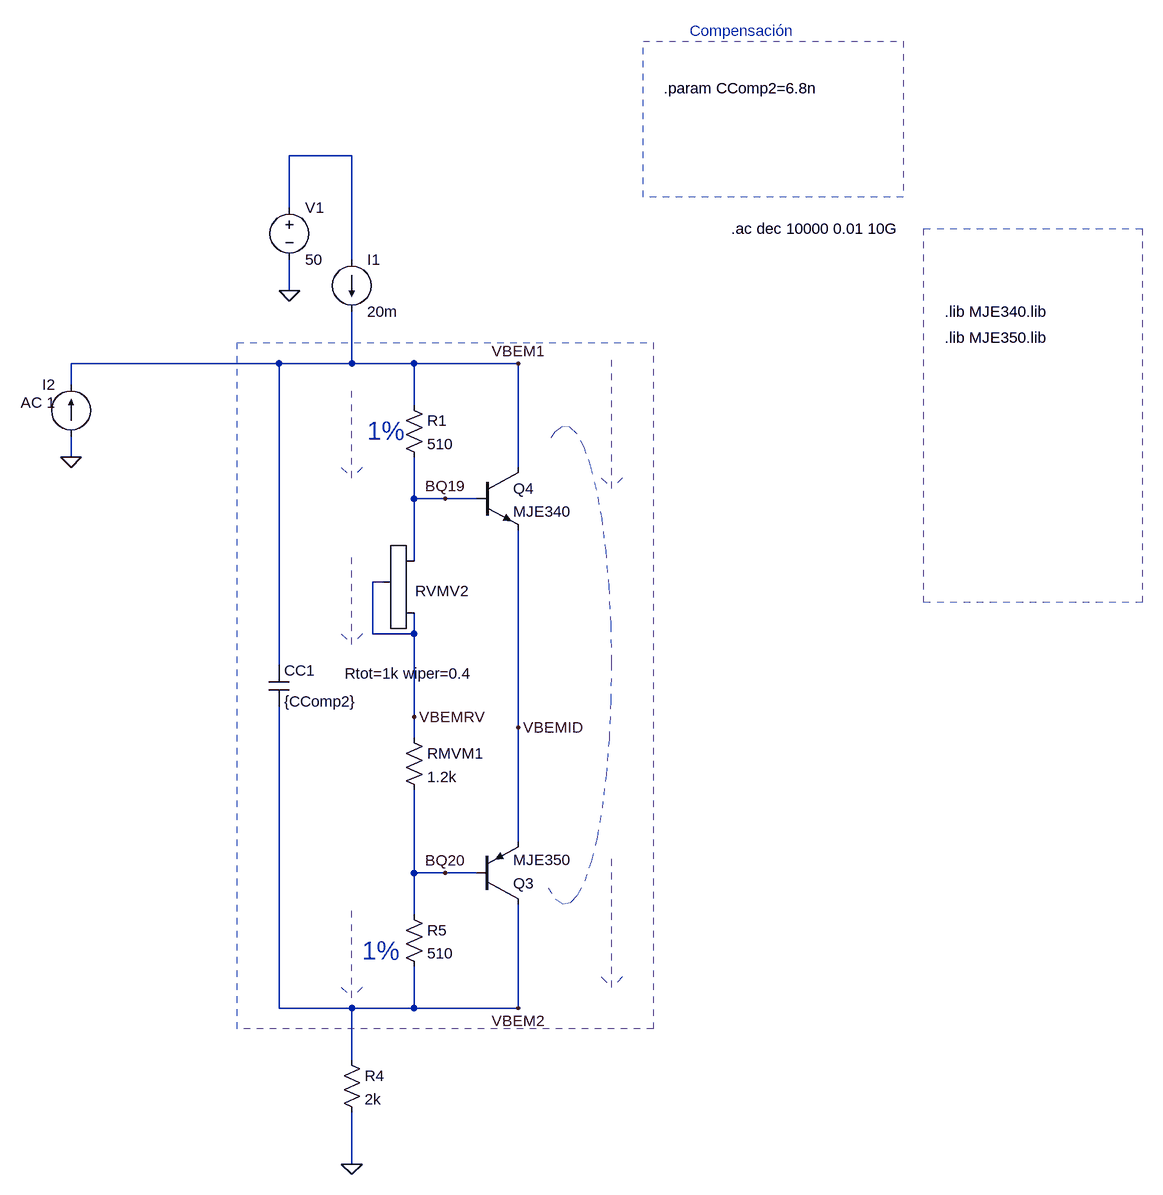
[diagram p0: schematic vbe_mult.asc]
vbe_mult.asc, the LTspice schematic file:
Version 4
SHEET 1 1316 964
WIRE 96 -608 0 -608
WIRE 0 -528 0 -608
WIRE 96 -448 96 -608
WIRE 0 -400 0 -448
WIRE -16 -288 -336 -288
WIRE 96 -288 96 -368
WIRE 96 -288 -16 -288
WIRE 192 -288 96 -288
WIRE 352 -288 192 -288
WIRE -336 -256 -336 -288
WIRE 192 -224 192 -288
WIRE -336 -144 -336 -176
WIRE 352 -128 352 -288
WIRE 192 -80 192 -144
WIRE 240 -80 192 -80
WIRE 288 -80 240 -80
WIRE 192 16 192 -80
WIRE 144 48 128 48
WIRE 128 128 128 48
WIRE 192 128 192 96
WIRE 192 128 128 128
WIRE -16 176 -16 -288
WIRE 192 256 192 128
WIRE 352 272 352 -32
WIRE 192 288 192 256
WIRE 352 448 352 272
WIRE 192 496 192 368
WIRE 240 496 192 496
WIRE 288 496 240 496
WIRE 192 560 192 496
WIRE -16 704 -16 240
WIRE 96 704 -16 704
WIRE 192 704 192 640
WIRE 192 704 96 704
WIRE 352 704 352 544
WIRE 352 704 192 704
WIRE 96 784 96 704
WIRE 96 944 96 864
FLAG 0 -400 0
FLAG 96 944 0
FLAG -336 -144 0
FLAG 352 -288 VBEM1
FLAG 352 704 VBEM2
FLAG 352 272 VBEMID
FLAG 240 -80 BQ19
FLAG 240 496 BQ20
FLAG 192 256 VBEMRV
DATAFLAG 496 208 "V(vbem1)-V(vbem2)"
DATAFLAG 496 704 ""
DATAFLAG 352 80 ""
DATAFLAG 496 -192 "Ic(Q19)"
DATAFLAG 496 576 "-Ic(Q20)"
DATAFLAG 192 -80 ""
DATAFLAG 192 496 ""
DATAFLAG 96 48 "I(RMVM)"
DATAFLAG 96 -208 "I(R21)"
DATAFLAG 96 592 "I(R22)"
SYMBOL current 96 -448 R0
SYMATTR InstName I1
SYMATTR Value 20m
SYMBOL voltage 0 -544 R0
SYMATTR InstName V1
SYMATTR Value 50
SYMBOL res 80 768 R0
SYMATTR InstName R4
SYMATTR Value 2k
SYMBOL current -336 -176 R180
WINDOW 0 24 80 Left 2
WINDOW 3 24 0 Left 2
WINDOW 123 24 52 Left 2
WINDOW 39 0 0 Left 0
SYMATTR InstName I2
SYMATTR Value ""
SYMATTR Value2 AC 1
SYMBOL pnp 288 544 M180
SYMATTR InstName Q3
SYMATTR Value MJE350
SYMBOL npn 288 -128 R0
SYMATTR InstName Q4
SYMATTR Value MJE340
SYMBOL res 176 -240 R0
SYMATTR InstName R1
SYMATTR Value 510
SYMBOL res 176 544 R0
SYMATTR InstName R5
SYMATTR Value 510
SYMBOL potentiometer_standard 208 112 R180
WINDOW 3 -74 -77 Left 2
WINDOW 0 -68 50 Left 2
WINDOW 38 50 -51 Left 2
SYMATTR Value Rtot=1k wiper=0.4
SYMATTR InstName RVMV2
SYMATTR SpiceLine ""
SYMBOL cap -32 176 R0
SYMATTR InstName CC1
SYMATTR Value {CComp2}
SYMBOL res 176 272 R0
SYMATTR InstName RMVM1
SYMATTR Value 1.2k
TEXT 680 -496 Left 2 !.ac dec 10000 0.01 10G
TEXT 1008 -368 Left 2 !.lib MJE340.lib
TEXT 1008 -328 Left 2 !.lib MJE350.lib
TEXT 120 -184 Left 4 ;1%
TEXT 112 616 Left 4 ;1%
TEXT 616 -800 Left 2 ;Compensación
TEXT 576 -712 Left 2 !.param CComp2=6.8n
LINE Normal 496 -96 496 -304 2
LINE Normal 496 -96 496 -96 2
LINE Normal 496 -96 496 -96 2
LINE Normal 480 -112 496 -96 2
LINE Normal 480 -112 480 -112 2
LINE Normal 512 -112 496 -96 2
LINE Normal 496 672 496 464 2
LINE Normal 496 672 496 672 2
LINE Normal 496 672 496 672 2
LINE Normal 480 656 496 672 2
LINE Normal 480 656 480 656 2
LINE Normal 512 656 496 672 2
LINE Normal 96 144 96 0 2
LINE Normal 96 144 96 144 2
LINE Normal 96 144 96 144 2
LINE Normal 80 128 96 144 2
LINE Normal 80 128 80 128 2
LINE Normal 112 128 96 144 2
LINE Normal 96 -112 96 -256 2
LINE Normal 96 -112 96 -112 2
LINE Normal 96 -112 96 -112 2
LINE Normal 80 -128 96 -112 2
LINE Normal 80 -128 80 -128 2
LINE Normal 112 -128 96 -112 2
LINE Normal 96 688 96 544 2
LINE Normal 96 688 96 688 2
LINE Normal 96 688 96 688 2
LINE Normal 80 672 96 688 2
LINE Normal 80 672 80 672 2
LINE Normal 112 672 96 688 2
RECTANGLE Normal 1312 80 976 -496 2
RECTANGLE Normal 560 736 -80 -320 3
RECTANGLE Normal 944 -544 544 -784 1
ARC Normal 352 -192 496 544 397 533 395 -187 2

The netlist it stands for:
* vbe_mult.asc
I1 N001 VBEM1 20m
V1 N001 0 50
R4 VBEM2 0 2k
I2 0 VBEM1 AC 1
Q3 VBEM2 BQ20 VBEMID 0 MJE350
Q4 VBEM1 BQ19 VBEMID 0 MJE340
R1 VBEM1 BQ19 510
R5 BQ20 VBEM2 510
XRVMV2 VBEMRV BQ19 VBEMRV Rtot=1k wiper=0.4
CC1 VBEM1 VBEM2 {CComp2}
RMVM1 VBEMRV BQ20 1.2k
.model NPN NPN
.model PNP PNP
.lib standard.bjt
.ac dec 10000 0.01 10G
.lib MJE340.lib
.lib MJE350.lib
* 1%
* 1%
* Compensación
.param CComp2=6.8n
.backanno
.end